# Altium schematic sheet Clock-management.SchDoc
size A4; SheetNumber: 1; SheetTotal: 6
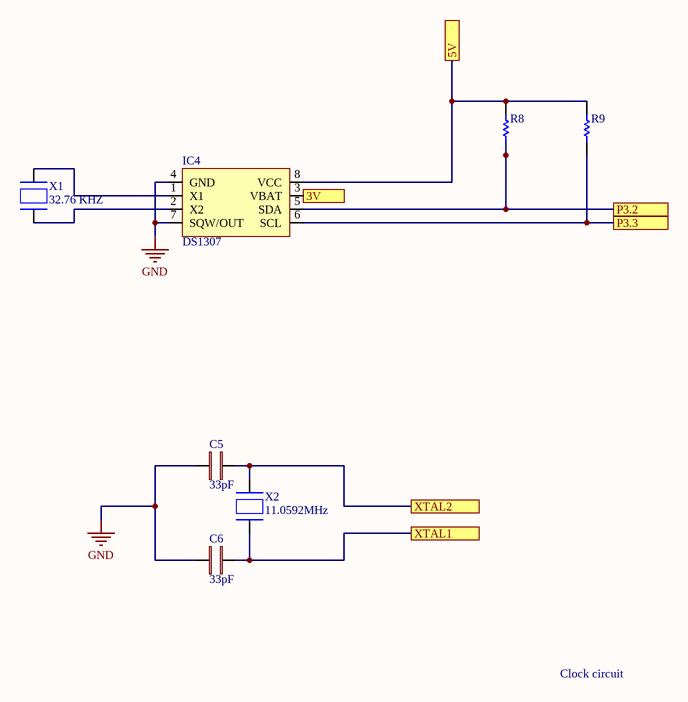
[diagram p0: Clock-management.SchDoc]

## Parts
C5  33pF  [250R07S330JV4T]
C6  33pF  [250R07S330JV4T]
IC4  DS1307  [DS1307]
R8  RC0805FR-0710KL  [RESC2013X60X35NL10T20]  (value not drawn)
R9  RC0805FR-0710KL  [RESC2013X60X35NL10T20]  (value not drawn)
X1  32.76 KHZ  [FC-12M]
X2  11.0592MHz  [HC-49/SM]

## Ports
3V, 5V, P3.2, P3.3, XTAL1, XTAL2

## Nets
GND: C5.2 C6.2 IC4.4(GND) IC4.7(SQW/OUT)
3V: IC4.3(VBAT) ; port 3V
5V: IC4.8(VCC) R8.2 R9.2 ; port 5V
P3.2: IC4.5(SDA) R8.1 ; port P3.2
P3.3: IC4.6(SCL) R9.1 ; port P3.3
XTAL1: C6.1 X2.1 ; port XTAL1
XTAL2: C5.1 X2.2 ; port XTAL2
NetIC4_1: IC4.1(X1) X1.1
NetIC4_2: IC4.2(X2) X1.2

## Notes on the sheet
- Clock circuit

## Library data of the parts
C5 C6 = 500R07S330JV4T: Cap Ceramic 33pF 50V C0G 5% Pad SMD 0402 125°C Ultra Low ESR T/R; Manufacturer: Johanson; Supplier 1: Newark; Manufacturer Part Number: 500R07S330JV4T; RoHS: Yes; Category: Ceramic Capacitors; Stock 1: 2779; Pricing 1: 1=0,22000, 10=0,15400, 25=0,12900, 50=0,10400, 100=0,07900 (USD); Mount: Surface Mount; Case/Package: 0402; Case Code (Metric): 1005; Case Code (Imperial): 0402; Min Operating Temperature: -55°C; Max Operating Temperature: 125°C; Dielectric: C0G; Capacitance: 33pF; Tolerance: 5%; Voltage Rating: 50V; Packaging: Tape and Reel; Voltage Rating (DC): 50V; Termination: SMD/SMT; Package Quantity: 1; Length: 1.02mm; Width: 0.02inch; Height: 0.64mm; Depth: 0.51mm; Thickness: 0.024inch; REACH SVHC: No SVHC; ComponentLink1URL: https://datasheet.ciiva.com/46417/1731432-46417670.pdf?src-supplier=Element14; ComponentLink1Description: https://datasheet.ciiva.com/46417/1731432-46417670.pdf?src-supplier=Element14; Supplier Part Number 1: 51Y5225
IC4 = DS1307ZNTR: IC RTC SERIAL 512K IND 8-SOIC; Manufacturer: Maxim; Logic Function: Clock; Time Format: HH:MM:SS; Operating Supply Voltage: 5V; Memory Size: 56B; Max Supply Voltage: 5.5V; Min Supply Voltage: 4.5V; Interface: I2C,Serial,2-Wire; Date Format: YY-MM-DD-dd; Voltage: 7V; Supplier 1: Digi-Key; Manufacturer Part Number: DS1307ZNTR; RoHS: Yes; Category: Real Time Clocks; Mount: Surface Mount; Case/Package: SOIC; Number of Pins: 8; Weight: 0.019048oz; Contact Plating: Tin,Matte; Min Operating Temperature: -40°C; Max Operating Temperature: 85°C; Packaging: Tape and Reel; Package Quantity: 2500; Series: -; Radiation Hardening: No; Lead Free: Lead Free; REACH SVHC: Unknown; ComponentLink1URL: https://datasheet.ciiva.com/1243/ds1307-1243264.pdf?src-supplier=Digi-Key; ComponentLink1Description: https://datasheet.ciiva.com/1243/ds1307-1243264.pdf?src-supplier=Digi-Key; ComponentLink2URL: https://datasheet.ciiva.com/18633/ds1307-18633131.pdf?src-supplier=Digi-Key; ComponentLink2Description: https://datasheet.ciiva.com/18633/ds1307-18633131.pdf?src-supplier=Digi-Key; ComponentLink3URL: https://datasheet.ciiva.com/3304/ds1307-3304460.pdf?src-supplier=Avnet; ComponentLink3Description: https://datasheet.ciiva.com/3304/ds1307-3304460.pdf?src-supplier=Avnet; ComponentLink4URL: https://datasheet.ciiva.com/18633/ds1307-18633132.pdf?src-supplier=Digi-Key; ComponentLink4Description: https://datasheet.ciiva.com/18633/ds1307-18633132.pdf?src-supplier=Digi-Key; ComponentLink5URL: https://datasheet.ciiva.com/28652/1647366-28652551.pdf?src-supplier=Element14; ComponentLink5Description: https://datasheet.ciiva.com/28652/1647366-28652551.pdf?src-supplier=Element14; Supplier Part Number 1: DS1307ZN+T&R-ND
R8 R9 = CMP-1659-00013-4: Chip Resistor, 10 KOhm, +/- 1%, 0.125 W, -55 to 155 degC, 0805 (2012 Metric), RoHS, Tape and Reel; Manufacturer: Yageo; Voltage Rating: 150 V; Mount: Surface Mount; ComponentLink1Description: Manufacturer URL; ComponentLink2URL: http://www.yageo.com/documents/recent/PYu-RC_Group_51_RoHS_L_04.pdf; Pins: 2; Length: 2 mm; Min Operating Temperature: -55 degC; Height: 0.5 mm; Mounting Technology: Surface Mount; RoHSCompliant: true; REACH SVHC: No SVHC; ComponentLink1URL: http://www.yageo.com/; Max Operating Temperature: 155 degC; PackageReference: 0805; DatasheetVersion: Rev. 4, 02/2016; Package Quantity: 5000; Packaging: Tape and Reel; ComponentLink2Description: Datasheet; PackageDescription: 2-Pin Surface Mounted Device, Body 2 x 1.25 mm
X1 = X1A0000610003 FC-12M 32.768KHZ 12.5PF: Crystal, FC-12M, 32.768 Khz, 12.5 Pf; Manufacturer: Epson; Load Capacitance: 12.5pF; Capacitance: 1.25E-11F; Supplier 1: Farnell; Manufacturer Part Number: X1A0000610003 FC-12M 32.768KHZ 12.5PF; RoHS: Yes; Stock 1: 2323; Pricing 1: 1=1,08000, 50=0,92000, 100=0,87600, 250=0,81700, 500=0,77000 (GBP); Mount: Surface Mount; Number of Pins: 2; Min Operating Temperature: -40°C; Max Operating Temperature: 85°C; Frequency: 32.768kHz; Packaging: Cut Tape; REACH SVHC: Unknown; ComponentLink1URL: https://datasheet.ciiva.com/48778/1734644-48778297.pdf?src-supplier=Element14; ComponentLink1Description: https://datasheet.ciiva.com/48778/1734644-48778297.pdf?src-supplier=Element14; ComponentLink2URL: https://datasheet.ciiva.com/48778/1734644-48778536.pdf?src-supplier=Element14; ComponentLink2Description: https://datasheet.ciiva.com/48778/1734644-48778536.pdf?src-supplier=Element14; ComponentLink3URL: https://datasheet.ciiva.com/48778/1734644-48778057.pdf?src-supplier=Element14; ComponentLink3Description: https://datasheet.ciiva.com/48778/1734644-48778057.pdf?src-supplier=Element14; Supplier Part Number 1: 1907468
X2 = HC49SM-11.0592-30-50-60-16-ATF: Crystal 11.0592MHz 16pF 2-Pin HC-49/U Loose; Manufacturer: Multicomp; Frequency Stability: 50ppm; Accuracy: 30ppm; Supplier 1: Newark; Manufacturer Part Number: HC49SM-11.0592-30-50-60-16-ATF; RoHS: Yes; Category: Crystals; Stock 1: 597; Pricing 1: 1=0,35400, 10=0,34000, 50=0,31600, 100=0,28300, 250=0,26100, 500=0,24300 (USD); Mount: Surface Mount; Case/Package: SMD/SMT; Number of Pins: 2; Min Operating Temperature: -10°C; Max Operating Temperature: 60°C; Load Capacitance: 16pF; Frequency: 11.0592MHz; Frequency Tolerance: 30ppm; Packaging: Cut Tape; REACH SVHC: No SVHC; ComponentLink1URL: https://datasheet.ciiva.com/8049/1661828-8049574.pdf?src-supplier=Element14; ComponentLink1Description: https://datasheet.ciiva.com/8049/1661828-8049574.pdf?src-supplier=Element14; ComponentLink2URL: https://datasheet.ciiva.com/22697/1661828-22697926.pdf?src-supplier=Element14; ComponentLink2Description: https://datasheet.ciiva.com/22697/1661828-22697926.pdf?src-supplier=Element14; Supplier Part Number 1: 33P6975